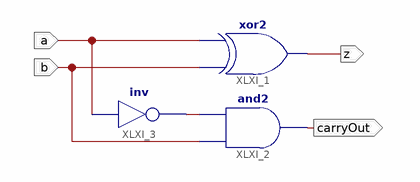
[diagram p0: schematic sheet 1]
// Xilinx ISE schematic halfSubtractor.sch (spartan6) as structural Verilog: 3 symbols, 4 ports
module halfSubtractor (
  input  a,
  input  b,
  output z,
  output carryOut
);

  wire XLXN_4;

  xor XLXI_1 (z, b, a);
  and XLXI_2 (carryOut, b, XLXN_4);
  not XLXI_3 (XLXN_4, a);
endmodule
